# EasyEDA Pro project ProProject_FPGA_oscilloscope Analog pre circuit PCB_2024-04-28.epro, board PCB4
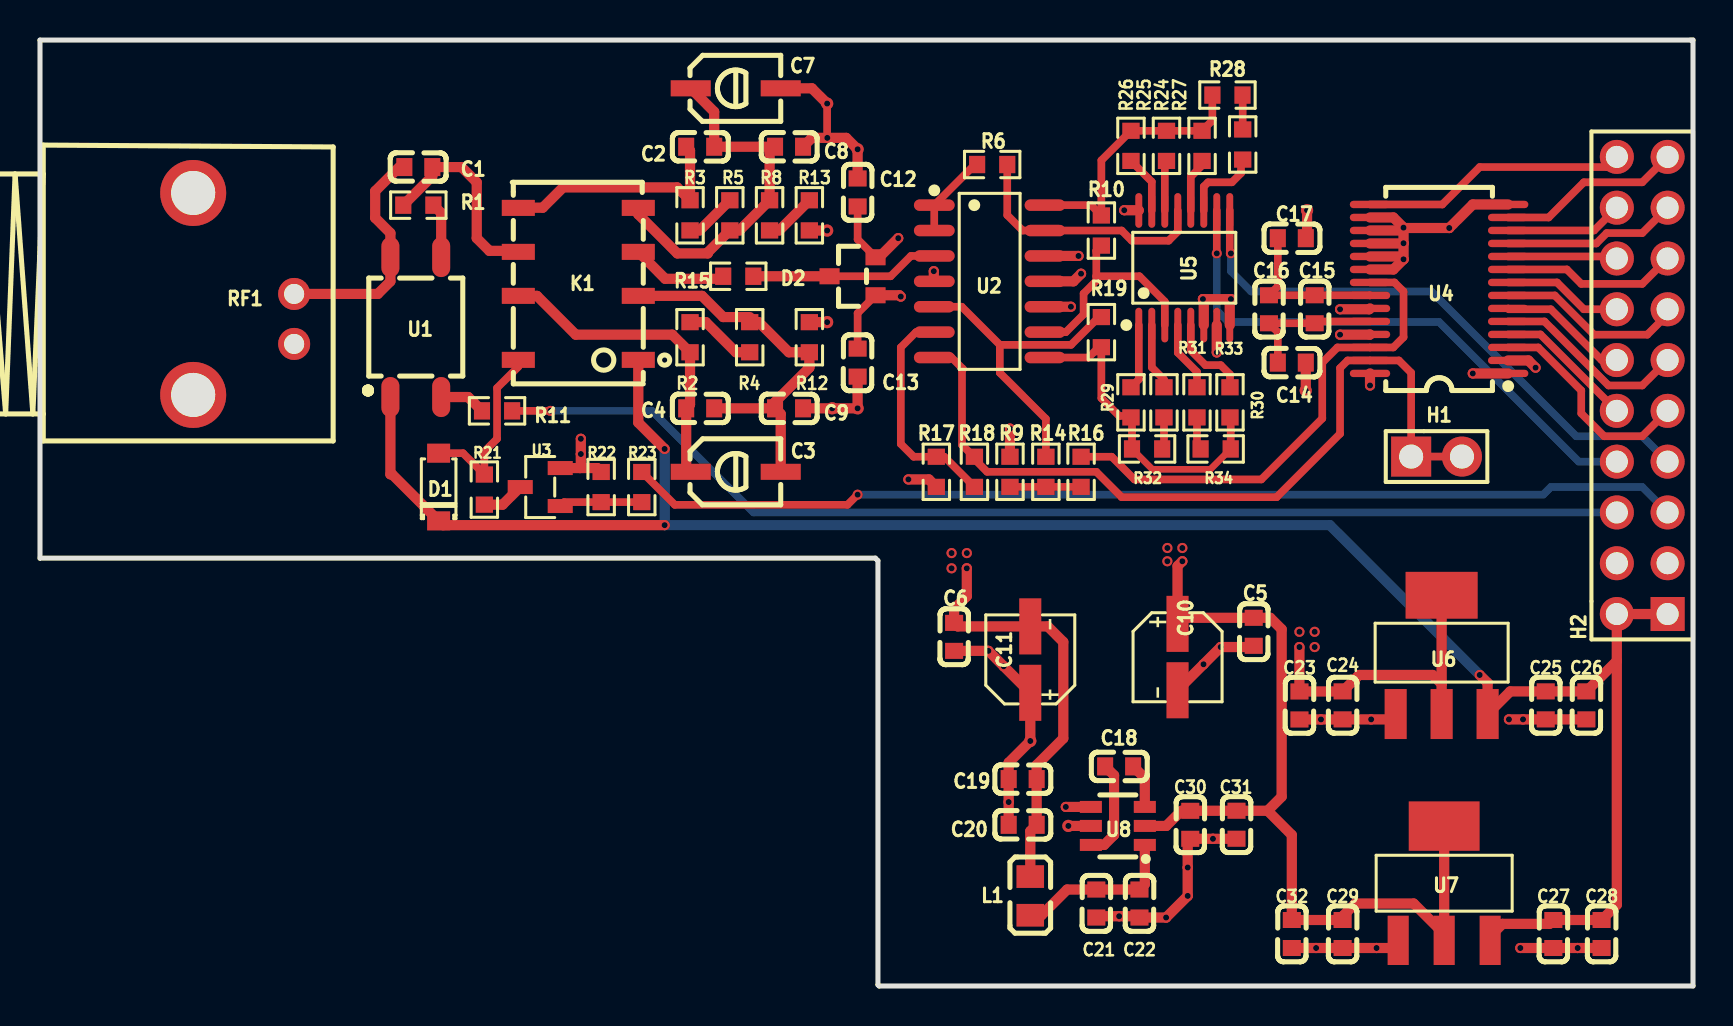
[diagram p6: board, top side]
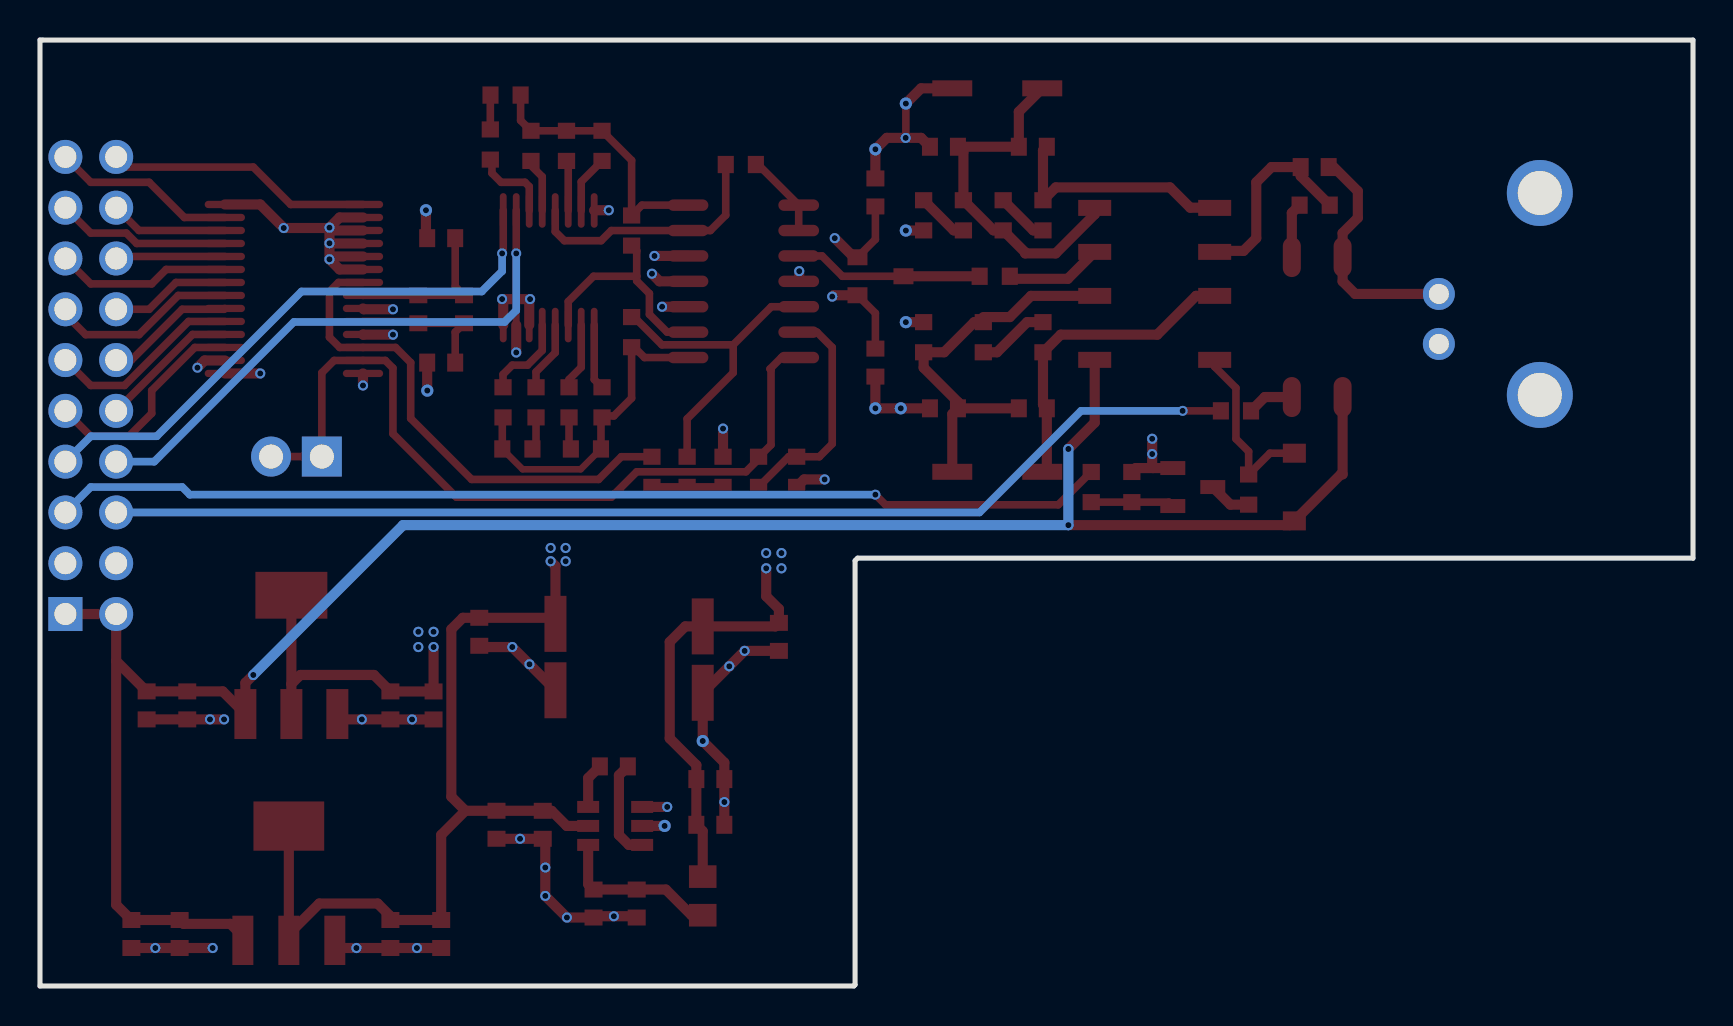
[diagram p7: board, bottom side, seen from below]

Outline 82.68 x 47.31 mm; copper layers: Top Layer, Inner1, Inner2, Bottom Layer. Coordinates in mm from the lower left corner of the outline.
Outline path: 0,47.3 82.55,47.3 82.68,47.31 82.68,0 41.97,0 41.91,0.06 41.91,21.27 41.78,21.4 0,21.4 0,47.3
Stack: Top Layer 0.035mm 外层铜厚1oz / Dielectric1 0.2104mm 7628 RC49% 8.6mil / Inner1 0.0152mm 内层铜厚 / Dielectric2 1.065mm 1.1mm H/HOZ 含铜 / Inner2 0.0152mm 内层铜厚 / Dielectric3 0.2104mm 7628 RC49% 8.6mil / Bottom Layer 0.035mm 外层铜厚1oz

## Design rules (mm)
template: 自定义配置
spacing copperThickness1oz (default): track to track 0.102, other pairs 0.152 to 0.3
spacing copperThickness2oz: track to track 0.203, other pairs 0.152 to 0.3
track width copperThickness1oz (default): min 0.127, default 0.254, max 2.54
track width copperThickness2oz: min 0.203, default 0.254, max 2.54
differential pair differentialPair (default): width min 0.127, default 0.254, max 2.54; gap min 0.152, default 0.152
via viaSize (default): diameter min 0.5, default 0.61, max 10; hole min 0.3, default 0.305, max 6.3

## Placement (name value [footprint] x y rotation side)
C1  22nF  [C0603]  18.92 40.95 0 top
C2  360pf  [C0603]  33.02 41.97 180 top
C3  TZC3Z060A110R00  [CAP-SMD_L4.50-W3.20]  34.8 25.71 0 top
C4  15Pf  [C0603]  33.02 28.89 180 top
C5  104pf  [C0603]  60.71 17.71 270 top
C6  104pf  [C0603]  45.72 17.46 270 top
C7  TZC3Z060A110R00  [CAP-SMD_L4.50-W3.20]  34.8 44.89 0 top
C8  15Pf  [C0603]  37.47 41.97 180 top
C9  360pf  [C0603]  37.47 28.89 180 top
C10  22uF  [CAP-SMD_BD4.0-L4.3-W4.3-FD-A]  56.9 16.45 270 top
C11  22uF  [CAP-SMD_BD4.0-L4.3-W4.3-FD-A]  49.53 16.32 90 top
C12  360pf  [C0603]  40.89 39.68 270 top
C13  360pf  [C0603]  40.89 31.18 90 top
C14  100nf  [C0603]  62.61 31.18 180 top
C15  100nf  [C0603]  63.75 33.84 270 top
C16  10uf  [C0603]  61.47 33.84 270 top
C17  100nf  [C0603]  62.61 37.4 180 top
C18  3.3uf  [C0603]  53.97 10.98 180 top
C19  100nf  [C0603]  49.15 10.35 180 top
C20  3.3uf  [C0603]  49.15 8.06 180 top
C21  10uf  [C0603]  52.83 4.12 270 top
C22  3.3uf  [C0603]  54.99 4.12 270 top
C23  100nf  [C0603]  62.99 14.03 270 top
C24  22uf  [C0603]  65.15 14.03 270 top
C25  10uf  [C0603]  75.31 14.03 270 top
C26  100nf  [C0603]  77.34 14.03 270 top
C27  100nf  [C0603]  75.69 2.6 270 top
C28  10uf  [C0603]  78.11 2.6 270 top
C29  22uf  [C0603]  65.15 2.6 270 top
C30  10uf  [C0603]  57.53 8.06 270 top
C31  3.3uf  [C0603]  59.84 8.06 270 top
C32  100nf  [C0603]  62.61 2.6 270 top
D1  1N4148W  [SOD-123_L2.8-W1.8-LS3.7-RD]  19.94 24.95 90 top
D2  BAV199LT1G  [SOT-23_L2.9-W1.3-P1.90-LS2.4-BR]  40.64 35.49 0 top
H1  PZ254V-11-02P  [HDR-TH_2P-P2.54-V-M]  69.85 26.48 0 top
H2  PZ254V-12-20P  [HDR-TH_20P-P2.54-V-M-R2-C10-S2.54]  80.14 30.03 90 top
K1  HFD4/3-S1R  [RELAY-SMD_HFD4-3-S1R]  26.92 35.11 90 top
L1  YI201209U121-5R0T  [L0805]  49.53 4.51 270 top
R1  56Ω  [R0603]  18.92 39.05 0 top
R2  680kΩ  [R0603]  32.51 32.45 270 top
R3  300kΩ  [R0603]  32.51 38.54 90 top
R4  300kΩ  [R0603]  35.5 32.45 270 top
R5  300kΩ  [R0603]  34.5 38.54 90 top
R6  1.5kΩ  [R0603]  47.62 41.08 180 top
R8  200kΩ  [R0603]  36.49 38.54 90 top
R9  3kΩ  [R0603]  48.51 25.71 270 top
R10  1.5kΩ  [R0603]  53.09 37.78 90 top
R11  1kΩ  [R0603]  22.86 28.76 180 top
R12  20kΩ  [R0603]  38.48 32.45 270 top
R13  200kΩ  [R0603]  38.48 38.54 90 top
R14  1.5kΩ  [R0603]  50.31 25.71 270 top
R15  100R  [R0603]  34.93 35.49 0 top
R16  3kΩ  [R0603]  52.07 25.71 90 top
R17  1.5kΩ  [R0603]  44.83 25.71 90 top
R18  1.5kΩ  [R0603]  46.74 25.71 270 top
R19  1.5kΩ  [R0603]  53.09 32.7 90 top
R21  100R  [R0603]  22.22 24.83 270 top
R22  10K  [R0603]  28.07 24.95 270 top
R23  100R  [R0603]  30.1 24.95 270 top
R24  1.5kΩ  [R0603]  58.12 42.02 90 top
R25  1.5kΩ  [R0603]  56.34 42.02 90 top
R26  3kΩ  [R0603]  54.57 42.02 90 top
R27  3kΩ  [R0603]  60.15 42.08 90 top
R28  1.5kΩ  [R0603]  59.39 44.55 180 top
R29  1.5kΩ  [R0603]  54.57 29.19 270 top
R30  3kΩ  [R0603]  59.52 29.19 270 top
R31  3kΩ  [R0603]  56.22 29.19 270 top
R32  1.5kΩ  [R0603]  55.37 26.86 180 top
R33  3kΩ  [R0603]  57.87 29.19 270 top
R34  3kΩ  [R0603]  58.8 26.86 0 top
RF1  KH-BNC75-3511  [ANT-TH_KH-BNC75-3511]  10.19 34.61 270 top
U1  AQY282SX  [SOP-4_L4.3-W4.4-P2.54-LS7.0-BL]  18.8 32.95 0 top
U2  GS8094-SR  [SOIC-14_L8.7-W3.9-P1.27-LS6.0-BL]  47.5 35.24 270 top
U3  SI2302ADS-T1-JSM  [SOT-23-3_L2.9-W1.3-P1.90-LS2.4-BR]  25.02 24.95 0 top
U4  MS9280  [SSOP-28_L10.2-W5.3-P0.65-LS7.8-BL]  69.98 34.86 90 top
U5  74HC4052PW,118  [TSSOP-16_L5.0-W4.4-P0.65-LS6.4-BL]  57.23 35.92 0 top
U6  AMS1117-3.3  [SOT-223-3_L6.5-W3.5-P3.05-LS7.0]  70.1 16.57 270 top
U7  AMS1117-2.5V  [SOT-223_L6.5-W3.5-P2.30-LS7.0-BR]  70.23 5.14 270 top
U8  SGM3204YN6G/TR  [SOT-23-6_L2.9-W1.6-P0.95-LS2.8-BR]  53.91 8.01 0 top

## Footprints (pads in the part's own frame, mm; a bottom-side part is the same pattern mirrored in y, then rotated)
ANT-TH_KH-BNC75-3511
  round 1.6 hole 1: 1(0,2.525) 2(2.5,2.525)
  round 3.3 hole 2.2: 3(5.05,-2.525) 4(-5.05,-2.525)
C0603
  rect 0.8x0.9 smd: 1(-0.7,0) 2(0.7,0)
CAP-SMD_BD4.0-L4.3-W4.3-FD-A
  rect 2.8x1.1 smd: 1(-1.661,0) 2(1.661,0)
CAP-SMD_L4.50-W3.20
  rect 2x0.8 smd: 1(-2.25,0) 2(2.25,0)
HDR-TH_2P-P2.54-V-M
  rect 2x2 hole 1.2: 1(-1.27,0)
  round 2 hole 1.2: 2(1.27,0)
HDR-TH_20P-P2.54-V-M-R2-C10-S2.54
  rect 1.7x1.7 hole 1.1: 1(-11.43,-1.27)
  round 1.7 hole 1.1: 2(-11.43,1.27) 3(-8.89,-1.27) 4(-8.89,1.27) 5(-6.35,-1.27) 6(-6.35,1.27) 7(-3.81,-1.27) 8(-3.81,1.27) 9(-1.27,-1.27) 10(-1.27,1.27) 11(1.27,-1.27) 12(1.27,1.27) 13(3.81,-1.27) 14(3.81,1.27) 15(6.35,-1.27) 16(6.35,1.27) 17(8.89,-1.27) 18(8.89,1.27) 19(11.43,-1.27) 20(11.43,1.27)
L0805
  rect 1.133x1.377 smd: 1(-0.966,0) 2(0.966,0)
R0603
  rect 0.806x0.864 smd: 1(-0.753,0) 2(0.753,0)
RELAY-SMD_HFD4-3-S1R
  rect 0.8x1.65 smd: 1(-3.8,-3) 2(-0.6,-3) 3(1.6,-3) 4(3.8,-3) 5(3.8,3) 6(1.6,3) 7(-0.6,3) 8(-3.8,3)
SOD-123_L2.8-W1.8-LS3.7-RD
  rect 0.95x1.15 smd: 1(-1.692,0) 2(1.692,0)
SOIC-14_L8.7-W3.9-P1.27-LS6.0-BL
  oval 0.574x2.038 smd: 1(-3.81,-2.769) 2(-2.54,-2.769) 3(-1.27,-2.769) 4(0,-2.769) 5(1.27,-2.769) 6(2.54,-2.769) 7(3.81,-2.769) 8(3.81,2.769) 9(2.54,2.769) 10(1.27,2.769) 11(0,2.769) 12(-1.27,2.769) 13(-2.54,2.769) 14(-3.81,2.769)
SOP-4_L4.3-W4.4-P2.54-LS7.0-BL
  oval 0.9x2 smd: 1(-1.27,-3.5) 2(1.27,-3.5) 3(1.27,3.5) 4(-1.27,3.5)
SOT-23-3_L2.9-W1.3-P1.90-LS2.4-BR
  rect 1.25x0.7 smd: 1(1,-0.95) 2(1,0.95) 3(-1,0)
SOT-23-6_L2.9-W1.6-P0.95-LS2.8-BR
  rect 1.1x0.6 smd: 1(1.35,-0.95) 2(1.35,0) 3(1.35,0.95) 4(-1.35,0.95) 5(-1.35,0) 6(-1.35,-0.95)
SOT-23_L2.9-W1.3-P1.90-LS2.4-BR
  rect 1x0.8 smd: 1(1.15,-0.95) 2(1.15,0.95) 3(-1.15,0)
SOT-223-3_L6.5-W3.5-P3.05-LS7.0
  rect 2.5x1.1 smd: 1(2.97,-2.3) 2(2.97,0) 3(2.97,2.3)
  rect 2.34x3.6 smd: 4(-2.97,0)
SOT-223_L6.5-W3.5-P2.30-LS7.0-BR
  rect 2.465x1.05 smd: 1(2.857,-2.3) 2(2.857,0) 3(2.857,2.3)
  rect 2.465x3.54 smd: 4(-2.857,0)
SSOP-28_L10.2-W5.3-P0.65-LS7.8-BL
  oval 0.364x2.015 smd: 1(-4.225,-3.455) 2(-3.575,-3.455) 3(-2.925,-3.455) 4(-2.275,-3.455) 5(-1.625,-3.455) 6(-0.975,-3.455) 7(-0.325,-3.455) 8(0.325,-3.455) 9(0.975,-3.455) 10(1.625,-3.455) 11(2.275,-3.455) 12(2.925,-3.455) 13(3.575,-3.455) 14(4.225,-3.455) 15(4.225,3.455) 16(3.575,3.455) 17(2.925,3.455) 18(2.275,3.455) 19(1.625,3.455) 20(0.975,3.455) 21(0.325,3.455) 22(-0.325,3.455) 23(-0.975,3.455) 24(-1.625,3.455) 25(-2.275,3.455) 26(-2.925,3.455) 27(-3.575,3.455) 28(-4.225,3.455)
TSSOP-16_L5.0-W4.4-P0.65-LS6.4-BL
  oval 0.343x1.732 smd: 1(-2.275,-2.866) 2(-1.625,-2.866) 3(-0.975,-2.866) 4(-0.325,-2.866) 5(0.325,-2.866) 6(0.975,-2.866) 7(1.625,-2.866) 8(2.275,-2.866) 9(2.275,2.866) 10(1.625,2.866) 11(0.975,2.866) 12(0.325,2.866) 13(-0.325,2.866) 14(-0.975,2.866) 15(-1.625,2.866) 16(-2.275,2.866)

## Nets
As in the schematic.

## Via types
v1: diameter 0.508, hole 0.305, Top Layer to Bottom Layer, 54 vias
v2: diameter 0.61, hole 0.305, Top Layer to Bottom Layer, 10 vias
v3: diameter 0.5, hole 0.305, Top Layer to Bottom Layer, 8 vias

## Routing (per net, layer and track width the routed paths; a pad name or vN(x,y) marks a point on that pad's centre or on a via; arc(x,y) is an arc through that point)
2.5V: length 50.6
  Top Layer w0.381: D2.2 40.89,37.34 C12.2
  Top Layer w0.508: U7.2 70.23,2.6 ; 70.23,2.6 U7.4 ; 70.23,2.6 68.71,4.12 65.79,4.12 65.15,3.49 C29.1 C32.1 62.61,7.55 61.4,8.76 ; 61.4,8.76 C31.1 57.53,8.76 C30.1 57.09,8.76 56.33,8.01 U8.2 ; 61.4,8.76 62.1,9.47 62.1,17.84 61.53,18.41 C5.1 57.2,18.41 57.14,18.35 ; C10.1 57.14,18.35 ; 57.14,18.35 56.9,18.59 56.9,21 v1(57.14,21.24) ; D2.2 41.97,36.44 v1(42.93,37.4) ; U5.16 54.95,38.8 v1(54.23,38.8) ; U2.4 44.7,35.26 v1(44.7,35.75)
  vias: v1(56.39,21.9) v1(56.39,21.24) v1(57.14,21.9)
2V: length 25.3
  Top Layer w0.381: R16.2 53.6,26.47 54.74,25.33 61.09,25.33 64.14,28.38 64.14,31.18 64.89,31.93 U4.26 67.69,31.93 68.2,32.45 68.2,34.73 67.75,35.18 U4.21
+5V: length 105.3
  Top Layer w0.508: 78.87,16.26 78.87,4.06 C28.1 C27.1 75.5,3.11 73.15,3.11 72.53,2.49 U7.3 ; 78.87,16.26 H2.2 H2.1 ; 78.87,16.26 C26.1 C25.1 73.54,14.73 U6.3 72.4,15.16 v3(72.01,15.55) ; v3(31.24,26.86) 29.92,28.18 K1.1 ; v3(31.24,23.05) 20.15,23.05 D1.1 17.61,25.59 17.53,25.59 U1.1
  Bottom Layer w0.508: v3(31.24,26.86) v3(31.24,23.05) 64.52,23.05 v3(72.01,15.55)
-2.5V: length 28.9
  Top Layer w0.381: D2.1 40.89,33.65 C13.2
  Top Layer w0.508: L1.1 49.53,7.74 49.85,8.06 49.85,11.05 51.18,12.38 51.18,17.21 50.4,17.98 C11.2 45.9,17.98 C6.1 45.72,18.86 46.36,19.49 v1(46.36,20.89) ; D2.1 42.99,34.54 v1(43.05,34.48) ; 50.27,35.24 51.69,35.24 v1(52.07,35.62) ; 58.86,33.05 v1(58.86,31.68)
  vias: v1(45.59,21.65) v1(45.59,20.89) v1(46.36,21.65)
GND: length 97.3
  Top Layer w0.381: v1(39.38,42.41) 39.37,42.42 v2(39.37,44.13)
  Top Layer w0.508: C7.2 38.61,44.89 v2(39.37,44.13) ; C12.1 v2(40.89,41.84) 40.32,42.41 v1(39.38,42.41) 38.61,42.41 38.17,41.97 ; v1(51.94,36.51) 50.27,36.51 ; v1(68.2,37.14) v1(68.2,36.34) ; v1(68.2,37.14) v1(68.2,37.93) ; v1(68.2,37.14) 68.19,37.13 U4.18 ; v1(68.2,36.34) 68.06,36.48 U4.19 ; v1(68.2,36.34) 67.69,35.83 66.52,35.83 ; C13.1 v2(40.89,28.89) v2(39.62,28.89) 38.17,28.89 ; v2(63.37,38.8) 63.37,37.46 C17.1 ; R13.1 38.49,37.78 v2(39.37,37.78) ; v1(68.2,37.93) 67.69,38.43 U4.16 ; v1(68.2,37.93) 68.06,37.78 U4.17 ; v1(68.2,37.93) 68.22,37.91 v1(70.49,37.91) 71.66,39.08 U4.14 ; R9.1 v1(48.51,27.87) ; 52.56,8.96 v1(51.31,8.96) ; C21.2 52.9,3.49 v1(53.97,3.49) 54.93,3.49 C22.2 v1(56.32,3.42) v1(57.4,4.51) v1(57.4,5.92) 57.4,7.23 C30.2 v1(58.67,7.36) 59.84,7.36 C31.2 ; C10.2 v1(58.19,16.09) 59.06,16.95 ; C23.2 v1(64.07,13.33) 65.15,13.33 65.15,13.33 v1(66.58,13.33) 67.54,13.33 U6.1 ; R22.1 27.87,25.9 27.01,25.9 ; 59.51,33.05 59.51,34.3 v1(59.56,34.35) v1(58.17,34.35) 58.21,34.31 58.21,33.05 ; 27.01,25.9 27.05,25.94 v1(27.05,26.6) v1(27.05,27.37) ; 27.01,25.9 U3.2 ; C14.1 63.31,29.78 v2(63.31,29.78) ; C5.2 60.64,16.95 v1(59.06,16.95) ; U7.1 67.55,1.9 v1(66.85,1.9) C29.2 v1(63.83,1.9) C32.2 ; v1(73.47,13.33) v1(74.18,13.33) 77.34,13.33 ; v1(71.66,30.63) U4.1 ; C6.2 v1(47.43,16.76) v1(48.2,15.99) C11.1 v2(49.53,12.25) 48.45,11.17 C19.2 v1(48.45,9.2) C20.2 ; v1(43.43,25.33) 44.46,25.33 R17.1 ; U4.25 66.51,32.57 v1(65.02,32.57) ; R12.1 v2(39.37,33.2) ; v1(74.04,1.9) C27.2 v1(76.91,1.9) C28.2 ; v1(51.56,33.97) 50.27,33.97
1Y0: length 2.7
  Top Layer w0.381: U5.12 57.56,40.47 58.12,41.04 R24.1
1Y1: length 2.5
  Top Layer w0.381: U5.14 56.26,41.18 R25.1
1Y2: length 2.9
  Top Layer w0.381: R26.1 55.61,40.22 55.61,38.78
1Y3: length 4
  Top Layer w0.381: U5.11 58.21,39.98 58.42,40.19 59.62,40.19 60.07,40.65 60.07,41.25 R27.1
1Z: length 12.8
  Top Layer w0.381: R6.1 48.38,38.55 49.15,37.78 54.1,37.78 54.61,37.27 56.45,37.27 56.91,37.73 U5.13
2Y0: length 3.3
  Top Layer w0.381: R29.1 54.96,30.33 54.96,33.05
2Y1: length 4.4
  Top Layer w0.381: R30.1 59.52,30.58 59.06,31.05 58.29,31.05 57.56,31.78 57.56,33.05
2Y2: length 3.4
  Top Layer w0.381: R31.1 56.22,30.33 55.61,30.94 55.61,33.05
2Y3: length 3.5
  Top Layer w0.381: R33.1 57.87,30.71 56.91,31.67 56.91,33.05
2Z: length 11.2
  Top Layer w0.381: 50.27,32.7 51.31,32.7 52.2,33.59 52.2,34.63 52.83,35.26 52.83,35.49 ; 52.83,35.49 52.83,36.77 R10.1 ; 52.83,35.49 54.99,35.49 56.26,34.23 56.26,33.05
3.3: length 36.9
  Top Layer w0.508: v1(62.99,16.95) C23.1 65.15,14.73 C24.1 65.97,15.55 69.65,15.55 70.1,15.1 ; U4.23 66.48,33.84 v1(65.02,33.84) ; U4.2 74.44,31.28 v3(74.8,30.92) ; 70.1,15.1 U6.4 ; 70.1,15.1 U6.2 ; U4.28 v1(66.52,30.03) ; 52.56,8.01 v2(51.44,8.01)
  Inner2 w0.508: v1(62.99,16.95) 62.99,15.05 55.95,8.01 v2(51.44,8.01)
  vias: v1(62.99,17.71) v1(63.75,17.71) v1(63.75,16.95)
ADC0_CLK: length 13.3
  Top Layer w0.381: H2.20 78.36,40.95 72.01,40.95 70.14,39.08 U4.15
AIN: length 9.5
  Top Layer w0.381: D2.3 42.55,35.49 43.56,36.51 44.73,36.51
  Top Layer w0.508: R15.2 D2.3
AIN1: length 40.9
  Top Layer w0.381: H1.2 H1.1 68.58,30.67 67.96,31.28 U4.27 65.41,31.28 65.02,30.9 65.02,27.62 61.85,24.44 54.1,24.44 52.83,25.71 47.37,25.71 46.74,26.35 R18.1 46.71,26.47 46.11,27.06 46.11,30.81 46.16,30.86 45.59,31.43 U2.7
ANGOUT1: length 13.4
  Top Layer w0.381: R28.2 58.64,43.28 R24.2 R25.2 R26.2 53.09,41.29 R10.2 52.57,39.05 50.27,39.05
ANGOUT2: length 16.5
  Top Layer w0.33: R32.2 55.63,25.84 58.54,25.84 R34.2
  Top Layer w0.381: R30.2 59.55,28.4 R34.2 ; 54.62,26.98 54.62,28.38 R29.2 54.49,28.51 53.97,28.51 53.09,29.4 53.09,32.07 52.44,31.43 50.27,31.43
D0: length 11
  Top Layer w0.381: H2.9 80.14,27.49 78.23,27.49 77.09,28.64 77.09,29.78 74.93,31.93 U4.3
D1: length 7
  Top Layer w0.381: U4.4 75.05,32.58 H2.10
D2: length 9.8
  Top Layer w0.381: U4.5 75.25,33.23 78.45,30.03 80.14,30.03 H2.11
D3: length 6.5
  Top Layer w0.381: U4.6 73.47,33.84 75.56,33.84 78.11,31.3 H2.12
D4: length 9.5
  Top Layer w0.381: U4.7 75.76,34.53 77.72,32.57 80.39,32.57 81.41,33.59 H2.13
D5: length 6
  Top Layer w0.381: H2.14 77.22,33.84 75.88,35.18 U4.8
D6: length 8.8
  Top Layer w0.381: 73.43,35.83 76.37,35.83 77.09,35.11 80.14,35.11 H2.15
D7: length 5.5
  Top Layer w0.381: U4.10 78.77,36.48 H2.16
D8: length 8.7
  Top Layer w0.381: U4.11 77.84,37.13 78.36,37.65 80.14,37.65 H2.17
D9: length 5.9
  Top Layer w0.381: H2.18 77.73,37.78 U4.12
DIORA0: length 57.4
  Top Layer w0.381: R11.1 v3(25.53,28.76)
  Bottom Layer w0.381: v3(25.53,28.76) 30.61,28.76 35.69,23.68 H2.6
DIORA1: length 52.9
  Top Layer w0.381: v3(40.89,24.57) 40.39,24.06 31.75,24.06 30.11,25.71 R23.1
  Bottom Layer w0.381: v3(40.89,24.57) 75.18,24.57 75.56,24.95 80.14,24.95 H2.5
OTR: length 9.2
  Top Layer w0.381: U4.13 75.46,38.43 77.22,40.19 80.14,40.19 H2.19
RE0: length 9.2
  Top Layer w0.381: D1.2 21.16,26.64 R21.1 22.22,26.73 22.86,27.37 22.86,29.91 23.92,30.97 K1.8
S0: length 28.1
  Top Layer w0.381: U5.10 v3(58.86,36.64)
  Bottom Layer w0.381: v3(58.86,36.64) 58.86,33.79 59.44,33.21 69.98,33.21 76.96,26.22 H2.8
S1: length 28.8
  Top Layer w0.381: U5.9 59.51,36.64
  Bottom Layer w0.381: v3(59.56,36.64) 59.56,35.75 60.58,34.73 69.6,34.73 76.84,27.49 80.14,27.49 H2.7
$3N35195: length 11.6
  Top Layer w0.508: 17.97,40.95 16.76,39.75 16.76,38.41 17.53,37.65 U1.4 17.53,35.24 16.9,34.61 RF1.1
$3N35196: length 2.3
  Top Layer w0.508: U1.2 21.42,29.45 R11.2
$3N35200: length 2.8
  Top Layer w0.508: U1.3 20.07,38.66 R1.2
$3N35204: length 15.9
  Top Layer w0.508: C3.1 32.32,25.94 C4.2 32.51,29.08 R2.2 32.5,31.69 31.62,32.57 26.8,32.57 24.86,34.51 K1.7
$3N35211: length 4.9
  Top Layer w0.508: K1.3 31.27,35.37 34.04,35.37 R15.1
$3N35218: length 4.2
  Top Layer w0.381: U3.1 26.22,24.2 R22.2 R23.2
$3N35226: length 2.2
  Top Layer w0.508: R21.2 23.14,24.07 U3.3
$3N35248: length 19.5
  Top Layer w0.508: 35.5,33.45 34.17,33.45 33.11,34.51 K1.2 ; C3.2 37.05,28.61 C9.2 ; C9.2 36.77,29.21 38.48,30.92 R12.2 37.46,31.69 35.95,33.2 R4.1 ; C9.2 C4.1
$3N35357: length 8.3
  Top Layer w0.508: U8.1 55.26,5.09 C22.1 C21.1 51.37,4.82 50.09,3.54 49.53,3.54
$3N35372: length 7.2
  Top Layer w0.381: U4.24 63.84,33.23 C15.2 C16.2 61.91,32.7 61.91,31.18
$3N35381: length 8.1
  Top Layer w0.381: 61.91,37.4 61.91,34.99 C16.1 C15.1 66.51,34.54 U4.22
$3N35397: length 5
  Top Layer w0.508: 52.56,7.06 53.22,7.06 53.72,7.55 53.72,10.54 C18.2
$3N35399: length 2.3
  Top Layer w0.508: U8.3 55.26,10.4 C18.1
$3N35401: length 18.1
  Top Layer w0.508: C7.1 33.72,43.72 C2.1 C8.2 36.49,41.7 R8.2 34.98,37.79 R5.1 33.4,36.69 33.4,36.64 31.88,36.64 29.92,38.59 K1.4
$3N35428: length 4.3
  Top Layer w0.381: R6.2 46.76,41.08 U2.1 U2.2
$3N35475: length 16.1
  Top Layer w0.381: 48.01,32.06 51.57,32.06 52.96,33.45 ; 48.01,32.06 48.01,30.67 50.31,28.36 R14.1 ; 48.01,32.06 46.1,33.97 U2.5
$3N35491: length 11.4
  Top Layer w0.381: U2.6 43.81,32.7 43.05,31.94 43.05,27.11 43.7,26.47 R17.2 45.23,26.47 R18.2
$3N35504: length 1.8
  Top Layer w0.381: 56.22,26.64 R31.2
$3N35506: length 1.7
  Top Layer w0.381: 60.14,44.55 60.15,44.55 R27.2
$3N35528: length 1.8
  Top Layer w0.381: 57.87,26.64 R33.2
$3N35540: length 2.6
  Top Layer w0.508: R13.2 36.97,37.79 R8.1
$3N35542: length 2.6
  Top Layer w0.508: R3.1 33,37.79 R5.2
$3N35544: length 3.6
  Top Layer w0.508: R2.1 33.3,33.2 34.81,31.69 R4.2
$3N35546: length 10.2
  Top Layer w0.508: R1.1 19.62,40.5 19.62,40.95 21.08,40.95 21.84,40.19 21.84,37.4 22.48,36.76 23.87,36.76 K1.6
$3N35551: length 12
  Top Layer w0.508: K1.5 23.93,38.92 25.15,38.92 26.16,39.94 31.87,39.94 R3.2 32.51,41.78 C2.2
$3N47882: length 3.6
  Top Layer w0.381: R9.2 R14.2 R16.1

## Copper pours and planes (outline as drawn; the poured copper is in the pictures)
2.5V on Top Layer: 56.01,22.29 57.53,22.29 57.53,20.89 56.01,20.89
2.5V on Inner2: 42.29,36.13 43.43,36.13 44.45,35.11 45.77,35.11 45.77,42.05 45.59,42.22 51.18,42.22 51.56,41.84 51.56,37.23 55.84,37.23 55.89,37.27 59.08,37.27 59.81,36.54 59.81,25.07 58.42,23.68 55.33,23.68 55.33,20.47 55.25,20.38 58.42,20.38 61.85,23.81 61.85,37.78 60.33,39.3 53.9,39.3 53.9,42.73 53.09,43.54 42.34,43.54 42.29,43.49
-2.5V on Top Layer: 44.96,22.16 46.86,22.16 46.86,20.38 44.96,20.38
-2.5V on Inner2: 51.69,36.38 54.36,36.38 54.36,32.05 59.17,32.05 59.17,29.66 59.31,29.52 54.48,29.52 54.36,29.4 54.36,21.02 53.72,20.38 45.09,20.38 44.45,21.02 44.45,27.87 42.29,30.03 42.29,35.34 43.72,35.34 43.81,35.24 43.81,31.56 44.7,30.67 51.69,30.67
GND on Inner1: 0.26,47.05 82.42,47.05 82.42,0.26 0.26,0.26
3.3 on Top Layer: 62.61,18.09 64.14,18.09 64.14,16.57 62.61,16.57
3.3 on Inner2: 62.61,16.57 64.75,16.57 65.91,17.73 65.91,29.65 74.99,29.65 74.99,31.37 74.8,31.56 72.31,31.56 72.31,30.63 67.7,30.63 67.7,34.09 67.56,34.22 64.47,34.14 64.47,31.24 62.61,28.76

Small or netless copper shapes (teardrops, artwork), in the pictures only: 19 on Inner1
